# EAGLE design TSOC-ESP8266-EM-1-0 (EAGLE 6.6.0)
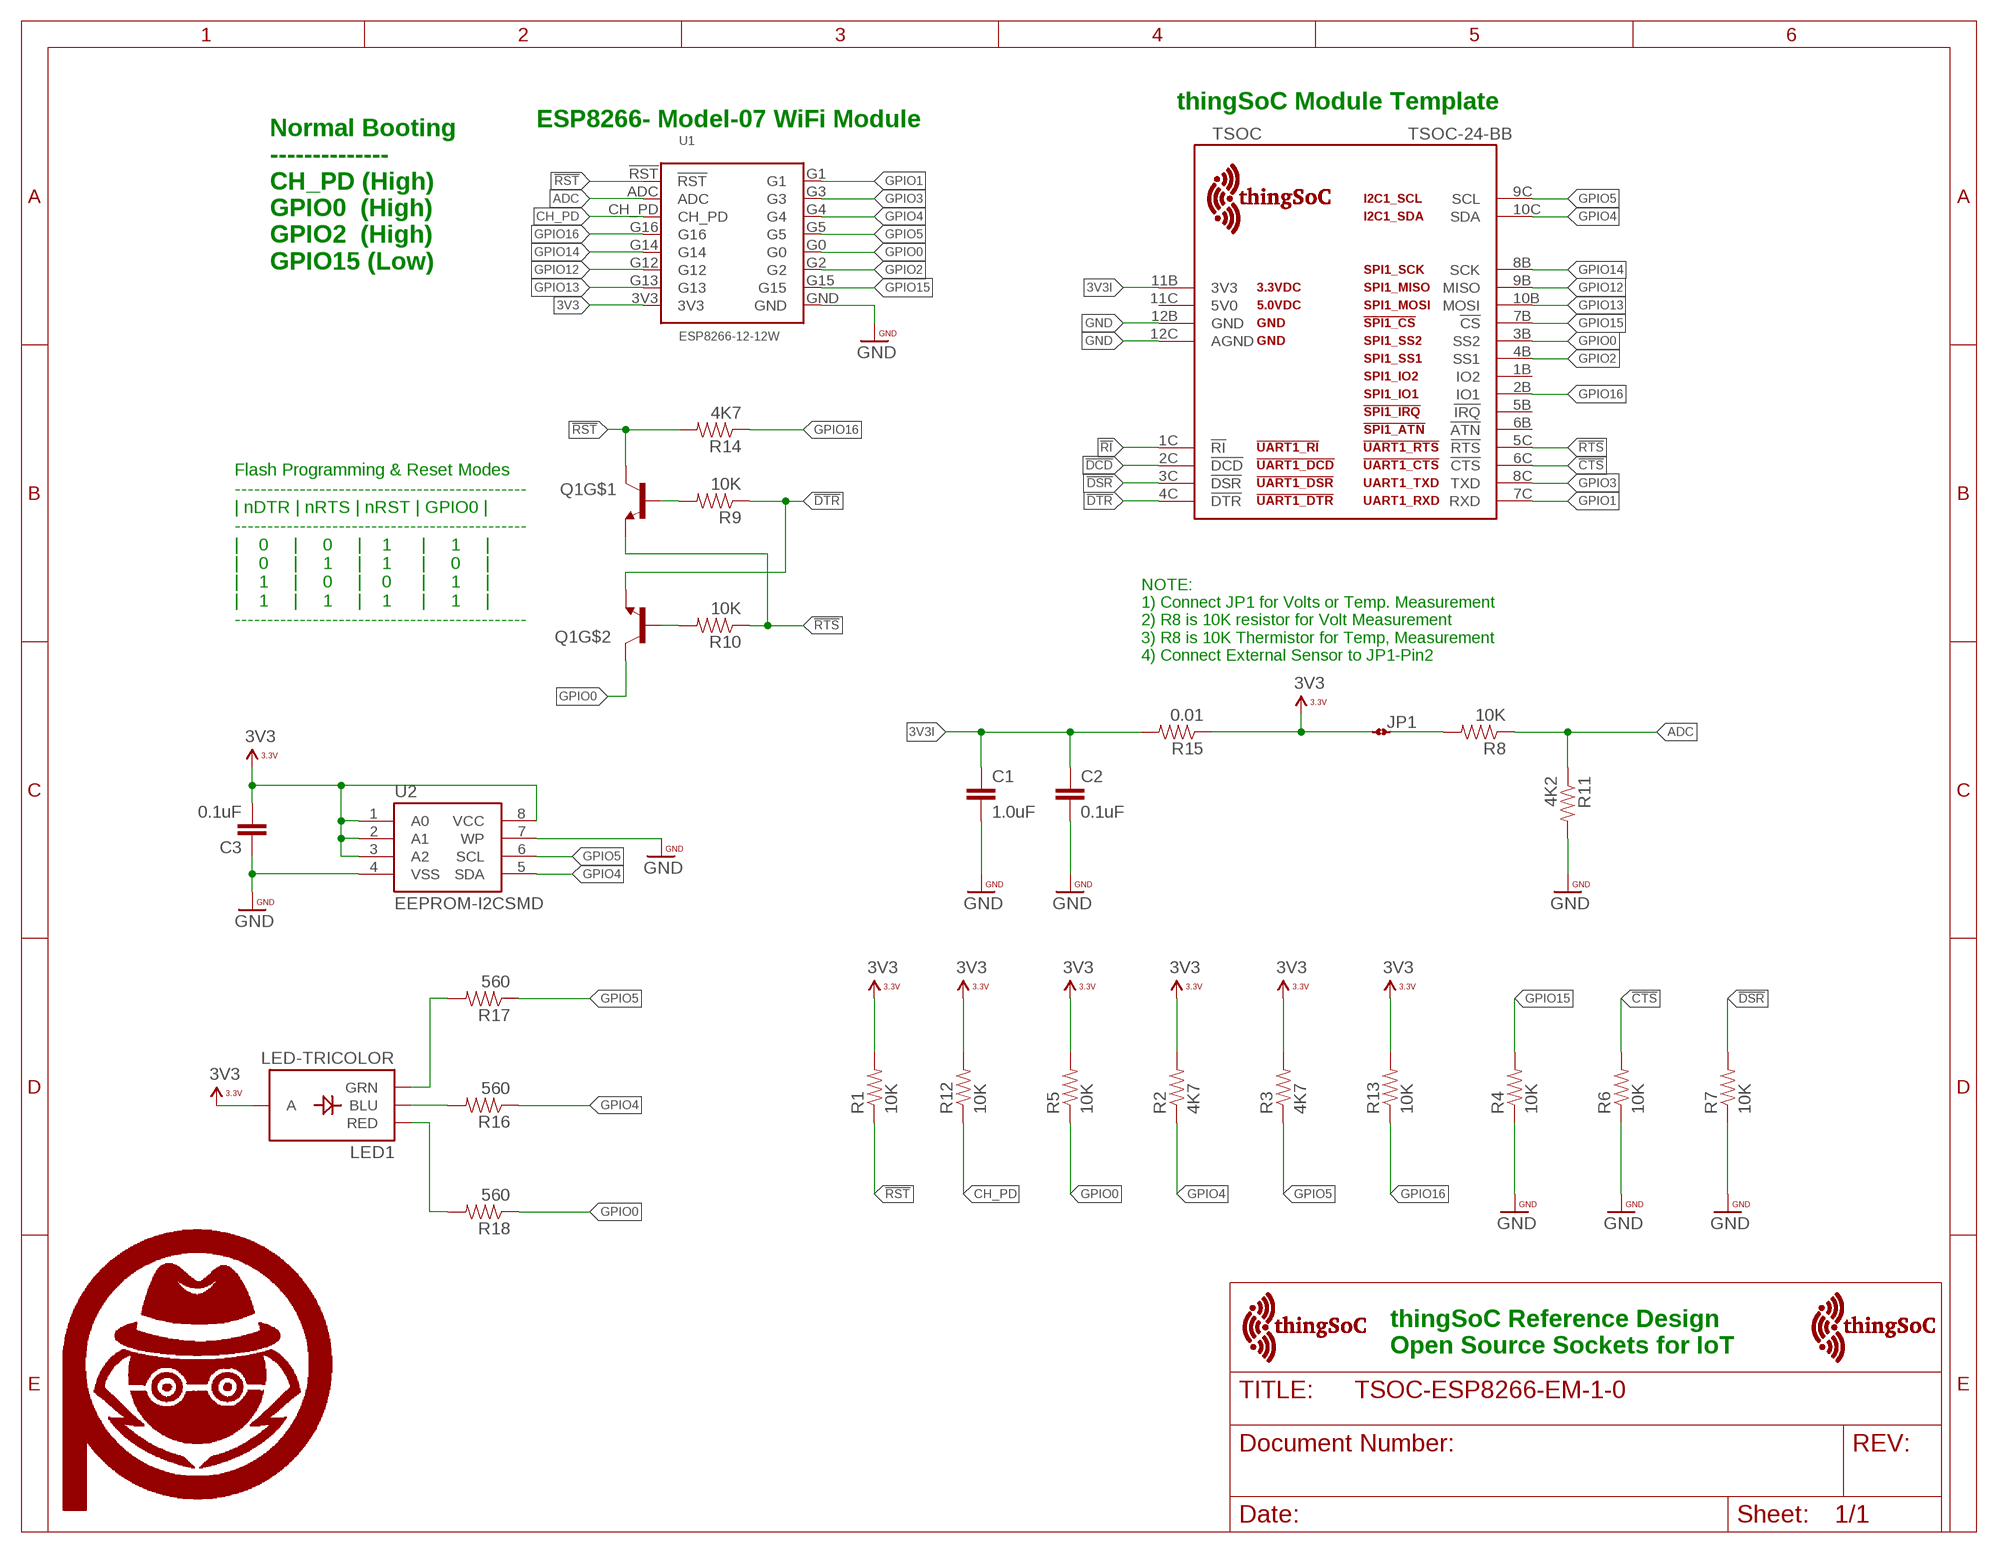
[diagram p0: schematic, sheet 1]

## Parts
C1  1.0uF  CAP0402-CAP  [0402-CAP]
C2  0.1uF  CAP0402-CAP  [0402-CAP]
C3  0.1uF  CAP0402-CAP  [0402-CAP]
JP1  JMP-2-NO-0402  [JMP-2-NO-0402]
LED1  LED-TRICOLOR  [LED-TRICOLOR-SMD]
Q1  MMBT2222A  MMDT3904  [SOT363]
R1  10K  RESISTOR0402  [0402-RES]
R2  4K7  RESISTOR0402  [0402-RES]
R3  4K7  RESISTOR0402  [0402-RES]
R4  10K  RESISTOR0402  [0402-RES]
R5  10K  RESISTOR0402  [0402-RES]
R6  10K  RESISTOR0402  [0402-RES]
R7  10K  RESISTOR0402  [0402-RES]
R8  10K  RESISTOR0402  [0402-RES]
R9  10K  RESISTOR0402  [0402-RES]
R10  10K  RESISTOR0402  [0402-RES]
R11  4K2  RESISTOR0402  [0402-RES]
R12  10K  RESISTOR0402  [0402-RES]
R13  10K  RESISTOR0402  [0402-RES]
R14  4K7  RESISTOR0402  [0402-RES]
R15  0.01  RESISTOR0402  [0402-RES]
R16  560  RESISTOR0402  [0402-RES]
R17  560  RESISTOR0402  [0402-RES]
R18  560  RESISTOR0402  [0402-RES]
TSOC  TSOC-24-BB  [TSOC-BB-S24]
U1  ESP8266-12-12W  [ESP8266-12W]
U2  EEPROM-I2CSMD  [SO08]
U$11  PA_LOGO_SYMMED  [PA_LOGO_AGENT_MED_SYM]
U$19  TSOC-LOGO-MED  [TSOC-LOGO-MED]
U$20  TSOC-LOGO-MED  [TSOC-LOGO-MED]

## Nets
3V3: C3.2 JP1.1 LED1.A R1.2 R2.2 R3.2 R5.2 R12.2 R13.2 R15.1 U1.3V3 U2.1(A0) U2.2(A1) U2.3(A2) U2.8(VCC)
3V3I: C1.1 C2.1 R15.2 TSOC.11B(3V3)
!CTS: R6.2 TSOC.6C(!CTS)
!DCD: TSOC.2C(!DCD)
!DSR: R7.2 TSOC.3C(!DSR)
!DTR: Q1.1(E) R9.1 TSOC.4C(!DTR)
!RI: TSOC.1C(!RI)
!RST: Q1.3(C) R1.1 R14.2 U1.!RST
!RTS: Q1.4(E) R10.1 TSOC.5C(!RTS)
ADC: R8.1 R11.1 U1.ADC
ADC_RAW: JP1.2 R8.2
BLU: LED1.B(BLU) R16.2
CH_PD: R12.1 U1.CH_PD
GND: C1.2 C2.2 C3.1 R4.1 R6.1 R7.1 R11.2 TSOC.12B(GND) TSOC.12C(AGND) U1.GND U2.4(VSS) U2.7(WP)
GPIO0: Q1.6(C) R5.1 R18.1 TSOC.3B(SS2) U1.G0
GPIO1: TSOC.7C(RXD) U1.G1
GPIO2: TSOC.4B(SS1) U1.G2
GPIO3: TSOC.8C(TXD) U1.G3
GPIO4: R2.1 R16.1 TSOC.10C(SDA) U1.G4 U2.5(SDA)
GPIO5: R3.1 R17.1 TSOC.9C(SCL) U1.G5 U2.6(SCL)
GPIO12: TSOC.9B(MISO) U1.G12
GPIO13: TSOC.10B(MOSI) U1.G13
GPIO14: TSOC.8B(SCK) U1.G14
GPIO15: R4.2 TSOC.7B(!CS) U1.G15
GPIO16: R13.1 R14.1 TSOC.2B(IO1) U1.G16
GRN: LED1.G(GRN) R17.2
N$6: Q1.5(B) R9.2
N$12: Q1.2(B) R10.2
RED: LED1.R(RED) R18.2
Unconnected: TSOC.1B(IO2) TSOC.5B(!IRQ) TSOC.6B(!ATN) TSOC.11C(5V0)

## Notes on the sheet
- thingSoC Module Template
- ESP8266- Model-07 WiFi Module
- Normal Booting
  --------------
  CH_PD (High)
  GPIO0  (High)
  GPIO2  (High) 
  GPIO15 (Low)
- Flash Programming & Reset Modes
  ---------------------------------------------
  | nDTR | nRTS | nRST | GPIO0 |
  ---------------------------------------------
  |    0     |     0     |    1      |     1     |
  |    0     |     1     |    1      |     0     |
  |    1     |     0     |    0      |     1     |
  |    1     |     1     |    1      |     1     |
  ---------------------------------------------
- NOTE:
  1) Connect JP1 for Volts or Temp. Measurement
  2) R8 is 10K resistor for Volt Measurement
  3) R8 is 10K Thermistor for Temp, Measurement
  4) Connect External Sensor to JP1-Pin2
- thingSoC Reference Design
  Open Source Sockets for IoT

## Library data of the parts
C1-C3 = PatternAgents-ProtoPads:CAP: Capacitor Standard 0603 ceramic capacitor, and 0.1" leaded capacitor.
JP1 = PatternAgents-ProtoPads:JMP-2-NO: Two Terminal Jumper - Normally Open Positions 1 and 2 are normally NOT connected. PatternAgents ProtoPads Library Schematic and PCB layout libraries for design patterns by PatternAgents. For the CADSoft Eagle CAD program : http://www.cadsoftusa.com/download-eagle/ Source LBR : http://www.patternagents.com Github : https://github.com/PatternAgents License : http://creativecommons.org/licenses/by-sa/4.0/ (Creative Commons 4.0) THIS SOFTWARE IS PROVIDED BY THE CONTRIBUTORS "AS IS" AND WITHOUT ANY EXPRESS OR IMPLIED WARRANTIES, INCLUDING, BUT NOT LIMITED TO, THE IMPLIED WARRANTIES OF MERCHANTABILITY AND FITNESS FOR A PARTICULAR PURPOSE ARE DISCLAIMED. IN NO EVENT SHALL THE COPYRIGHT OWNER OR CONTRIBUTORS BE LIABLE FOR ANY DIRECT, INDIRECT, INCIDENTAL, SPECIAL, EXEMPLARY, OR CONSEQUENTIAL DAMAGES (INCLUDING, BUT NOT LIMITED TO, PROCUREMENT OF SUBSTITUTE GOODS OR SERVICES; LOSS OF USE, DATA, OR PROFITS; OR BUSINESS INTERRUPTION) HOWEVER CAUSED AND ON ANY THEORY OF LIABILITY, WHETHER IN CONTRACT, STRICT LIABILITY, OR TORT (INCLUDING NEGLIGENCE OR OTHERWISE) ARISING IN ANY WAY OUT OF THE USE OF THIS SOFTWARE, EVEN IF ADVISED OF THE POSSIBILITY OF SUCH DAMAGE.; BOM: EXCLUDE
LED1 = SparkFun-LED:LED-TRICOLOR: Tri-Color LED SMD Proven layout and schematic for triple color LED in SMD package - common anode. Spark Fun Electronics SKU : COM-07844
Q1 = SparkFun-DiscreteSemi:MMDT3904: Dual NPN transistor
R1-R18 = PatternAgents-ProtoPads:RESISTOR: Resistor Basic schematic elements and footprints for 0603, 1206, and PTH resistors.
TSOC = thingSoC:TSOC-24: thingSoC Twenty-Four(24) Pin Socket Source LBR : http://www.thingsoc.com Github : https://github.com/thingsoc License : http://creativecommons.org/licenses/by-sa/4.0/ (Creative Commons 4.0) THIS SOFTWARE IS PROVIDED BY THE CONTRIBUTORS "AS IS" AND WITHOUT ANY EXPRESS OR IMPLIED WARRANTIES, INCLUDING, BUT NOT LIMITED TO, THE IMPLIED WARRANTIES OF MERCHANTABILITY AND FITNESS FOR A PARTICULAR PURPOSE ARE DISCLAIMED. IN NO EVENT SHALL THE COPYRIGHT OWNER OR CONTRIBUTORS BE LIABLE FOR ANY DIRECT, INDIRECT, INCIDENTAL, SPECIAL, EXEMPLARY, OR CONSEQUENTIAL DAMAGES (INCLUDING, BUT NOT LIMITED TO, PROCUREMENT OF SUBSTITUTE GOODS OR SERVICES; LOSS OF USE, DATA, OR PROFITS; OR BUSINESS INTERRUPTION) HOWEVER CAUSED AND ON ANY THEORY OF LIABILITY, WHETHER IN CONTRACT, STRICT LIABILITY, OR TORT (INCLUDING NEGLIGENCE OR OTHERWISE) ARISING IN ANY WAY OUT OF THE USE OF THIS SOFTWARE, EVEN IF ADVISED OF THE POSSIBILITY OF SUCH DAMAGE.
U1 = PatternAgents_RFmodules:ESP8266-12: Pattern Agents ESP8266 (Type12 : 16 Pins) PatternAgents Prototyping/Pads Library Schematic & PCB Layout Symbols for Prototyping Boards. Pads in this library have been lengthened for hand soldering & prototyping. Schematic and PCB layout libraries for design patterns by PatternAgents. For the CADSoft Eagle CAD program : http://www.cadsoftusa.com/download-eagle/ Github : https://github.com/PatternAgents License : http://creativecommons.org/licenses/by-sa/4.0/ (Creative Commons 4.0) THIS SOFTWARE IS PROVIDED BY THE CONTRIBUTORS "AS IS" AND WITHOUT ANY EXPRESS OR IMPLIED WARRANTIES, INCLUDING, BUT NOT LIMITED TO, THE IMPLIED WARRANTIES OF MERCHANTABILITY AND FITNESS FOR A PARTICULAR PURPOSE ARE DISCLAIMED. IN NO EVENT SHALL THE COPYRIGHT OWNER OR CONTRIBUTORS BE LIABLE FOR ANY DIRECT, INDIRECT, INCIDENTAL, SPECIAL, EXEMPLARY, OR CONSEQUENTIAL DAMAGES (INCLUDING, BUT NOT LIMITED TO, PROCUREMENT OF SUBSTITUTE GOODS OR SERVICES; LOSS OF USE, DATA, OR PROFITS; OR BUSINESS INTERRUPTION) HOWEVER CAUSED AND ON ANY THEORY OF LIABILITY, WHETHER IN CONTRACT, STRICT LIABILITY, OR TORT (INCLUDING NEGLIGENCE OR OTHERWISE) ARISING IN ANY WAY OUT OF THE USE OF THIS SOFTWARE, EVEN IF ADVISED OF THE POSSIBILITY OF SUCH DAMAGE.
U2 = SparkFun-DigitalIC:EEPROM-I2C: I2C EEPROM chips, 24LC256 (and others)
U$11 = PatternAgents-Logos:PA_LOGO_SYM: PatternAgents Logo Symbol Trademark : PatternAgents, LLC Github : https://github.com/PatternAgents/PCB_Libraries License : http://creativecommons.org/licenses/by-sa/3.0/ (Creative Commons 3.0) THIS SOFTWARE IS PROVIDED BY THE CONTRIBUTORS "AS IS" AND WITHOUT ANY EXPRESS OR IMPLIED WARRANTIES, INCLUDING, BUT NOT LIMITED TO, THE IMPLIED WARRANTIES OF MERCHANTABILITY AND FITNESS FOR A PARTICULAR PURPOSE ARE DISCLAIMED. IN NO EVENT SHALL THE COPYRIGHT OWNER OR CONTRIBUTORS BE LIABLE FOR ANY DIRECT, INDIRECT, INCIDENTAL, SPECIAL, EXEMPLARY, OR CONSEQUENTIAL DAMAGES (INCLUDING, BUT NOT LIMITED TO, PROCUREMENT OF SUBSTITUTE GOODS OR SERVICES; LOSS OF USE, DATA, OR PROFITS; OR BUSINESS INTERRUPTION) HOWEVER CAUSED AND ON ANY THEORY OF LIABILITY, WHETHER IN CONTRACT, STRICT LIABILITY, OR TORT (INCLUDING NEGLIGENCE OR OTHERWISE) ARISING IN ANY WAY OUT OF THE USE OF THIS SOFTWARE, EVEN IF ADVISED OF THE POSSIBILITY OF SUCH DAMAGE.
U$19 U$20 = thingSoC:TSOC-LOGO: thingSoC Logo Source LBR : http://www.thingsoc.com Github : https://github.com/thingsoc License : http://creativecommons.org/licenses/by-sa/4.0/ (Creative Commons 4.0) THIS SOFTWARE IS PROVIDED BY THE CONTRIBUTORS "AS IS" AND WITHOUT ANY EXPRESS OR IMPLIED WARRANTIES, INCLUDING, BUT NOT LIMITED TO, THE IMPLIED WARRANTIES OF MERCHANTABILITY AND FITNESS FOR A PARTICULAR PURPOSE ARE DISCLAIMED. IN NO EVENT SHALL THE COPYRIGHT OWNER OR CONTRIBUTORS BE LIABLE FOR ANY DIRECT, INDIRECT, INCIDENTAL, SPECIAL, EXEMPLARY, OR CONSEQUENTIAL DAMAGES (INCLUDING, BUT NOT LIMITED TO, PROCUREMENT OF SUBSTITUTE GOODS OR SERVICES; LOSS OF USE, DATA, OR PROFITS; OR BUSINESS INTERRUPTION) HOWEVER CAUSED AND ON ANY THEORY OF LIABILITY, WHETHER IN CONTRACT, STRICT LIABILITY, OR TORT (INCLUDING NEGLIGENCE OR OTHERWISE) ARISING IN ANY WAY OUT OF THE USE OF THIS SOFTWARE, EVEN IF ADVISED OF THE POSSIBILITY OF SUCH DAMAGE.

## Board
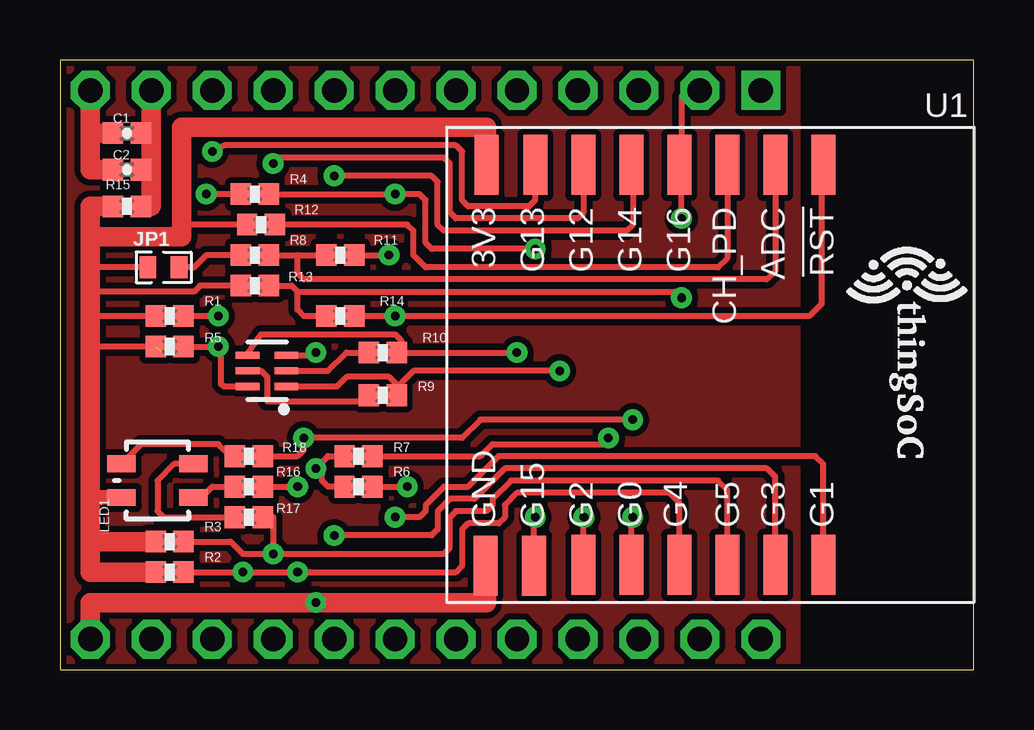
[diagram p1: board, top side]
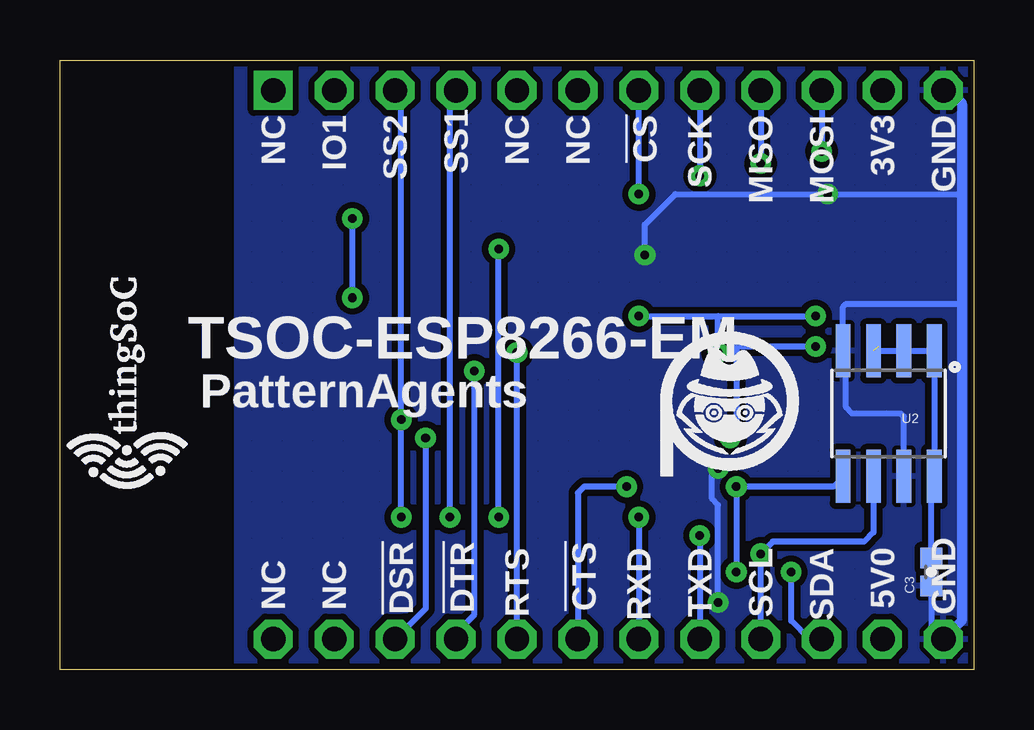
[diagram p2: board, bottom side, seen from below]

Size 38.1 x 25.4 mm. Coordinates in mm from the lower left corner, seen from the top.
Outline: 0,0 38.1,0 38.1,25.4 0,25.4 0,0
Copper layers (1*16): Top 0.035mm / dielectric 1.5mm / Bottom 0.035mm
Design rules "PatternAgents_7mil": minimum track width 7mil, minimum drill 14mil, track to track 7mil, track to pad 7mil, pad to pad 7mil, via to via 7mil, smd to smd 7mil, copper to edge 7mil, drill to drill 7mil, minimum pad ring 12mil, minimum via ring 10mil, stop-mask expansion 4mil, vias tented up to drill 25mil, thermal gap 7mil

### Footprints (pad centres in the part's own frame; a part is rotated, then mirrored left to right if it is on the bottom)
0402-CAP = smd 0.85 x 0.9: 1 -0.58,0; 2 0.58,0
JMP-2-NO-0402 = smd 0.7 x 0.9: 1 -0.65,0; 2 0.65,0
LED-TRICOLOR-SMD = smd 0.7 x 1.2: A 0.7,-1.5; B 0.7,1.5; G -0.7,1.5; R -0.7,-1.5
SOT363 = smd 0.3 x 0.99: 1 -0.65,-0.8; 2 0,-0.8; 3 0.65,-0.8; 4 0.65,0.81; 5 0,0.81; 6 -0.65,0.81
0402-RES = smd 0.85 x 0.9: 1 -0.58,0; 2 0.58,0
TSOC-BB-S24 = drill 1.016 square: 1B -11.43,-11.43 | drill 1.016 octagon: 1C -11.43,11.43; 2B -8.89,-11.43; 2C -8.89,11.43; 3B -6.35,-11.43; 3C -6.35,11.43; 4B -3.81,-11.43; 4C -3.81,11.43; 5B -1.27,-11.43; 5C -1.27,11.43; 6B 1.27,-11.43; 6C 1.27,11.43; 7B 3.81,-11.43; 7C 3.81,11.43; 8B 6.35,-11.43; 8C 6.35,11.43; 9B 8.89,-11.43; 9C 8.89,11.43; 10B 11.43,-11.43; 10C 11.43,11.43; 11B 13.97,-11.43; 11C 13.97,11.43; 12B 16.51,-11.43; 12C 16.51,11.43
ESP8266-12W = smd 1 x 2.5: 3V3 8.888,-8.582; !RST -5.144,-8.582; ADC -3.144,-8.582; CH_PD -1.144,-8.582; G0 2.856,8.082; G1 -5.144,8.082; G2 4.856,8.082; G3 -3.144,8.082; G4 0.856,8.082; G5 -1.144,8.082; G12 4.856,-8.582; G13 6.856,-8.582; G14 2.856,-8.582; G15 6.904,8.126; G16 0.856,-8.582; GND 8.936,8.126
SO08 = smd 0.61 x 2.21: 1 -1.905,-2.616; 2 -0.635,-2.616; 3 0.635,-2.616; 4 1.905,-2.616; 5 1.905,2.616; 6 0.635,2.616; 7 -0.635,2.616; 8 -1.905,2.616

### Placement (x,y rotation side)
C1  2.79,22.35 180 top
C2  2.79,20.83 180 top
C3  1.78,4.06 90 bottom
JP1  4.32,16.76 0 top
LED1  4.06,7.87 270 top
Q1  8.64,12.45 90 top
R1  4.57,14.73 180 top
R2  4.57,4.06 180 top
R3  4.57,5.33 180 top
R4  8.13,19.81 0 top
R5  4.57,13.46 180 top
R6  12.45,7.62 0 top
R7  12.45,8.89 0 top
R8  8.13,17.27 180 top
R9  13.46,11.43 180 top
R10  13.46,13.21 180 top
R11  11.68,17.27 0 top
R12  8.38,18.54 180 top
R13  8.13,16 180 top
R14  11.68,14.73 0 top
R15  2.79,19.3 0 top
R16  7.87,7.62 180 top
R17  7.87,6.35 180 top
R18  7.87,8.89 180 top
TSOC  17.78,12.7 180 top
U1  26.67,12.45 180 top
U2  3.56,10.67 180 bottom
U$11  10.16,10.67 0 bottom
U$19  35.31,9.14 90 bottom
U$20  35.31,16 270 top

### Tracks (layer width: path | path; a pad name or v marks a point on that pad's centre or on a via)
3V3  (1 unrouted)
  Top 0.254: R12.2 5.08,18.54 | R1.2 1.27,14.73 | JP1.1 1.27,16.76 | R13.2 5.84,16 5.59,15.75 1.52,15.75 1.27,16 | R5.2 1.27,13.46
  Top 0.61: 1.25,9.88 1.27,10.16 | LED1.A 1.46,7.17 1.27,7.37
  Top 0.813: 1.27,18.03 1.27,19.3 R15.1 | 1.27,18.03 1.27,16.76 1.27,16 1.27,14.73 1.27,13.46 1.27,10.16 1.27,7.37 1.27,5.33 | 1.27,5.33 1.27,4.06 R2.2 | R3.2 1.27,5.33 | U1.3V3 17.78,22.61 5.08,22.61 5.08,18.54 5.08,18.03 1.27,18.03
  Bottom 0.254: U2.3 U2.2 U2.1 U2.8 1.78,7.92 C3.2
3V3I
  Top 0.813: TSOC.11B 3.81,22.35 | 3.81,22.35 3.81,20.83 | 3.81,20.83 3.81,19.3 R15.2 | C1.1 3.81,22.35 | C2.1 3.81,20.83
!CTS  (via drill 0.36)
  Top 0.254: R6.2 v14.48,7.62
  Bottom 0.254: v14.48,7.62 16.26,7.62 16.51,7.37 TSOC.6C
!DSR  (via drill 0.36)
  Top 0.254: R7.2 17.53,8.89 18.03,9.4 22.61,9.4 v22.86,9.65
  Bottom 0.254: v22.86,9.65 22.86,2.54 TSOC.3C
!DTR  (via drill 0.36)
  Top 0.254: 14.3,11.68 R9.1 | R9.1 14.04,11.87 13.72,12.19 11.94,12.19 11.54,11.8 Q1.1 | v20.83,12.45 14.73,12.45 14.22,11.94 14.22,11.61 R9.1
  Bottom 0.254: TSOC.4C 21.59,1.52 20.83,2.29 v20.83,12.45
!RST  (via drill 0.36)
  Top 0.178: U1.!RST 31.75,21.08 31.75,20.96
  Top 0.254: 31.75,20.96 31.75,15.24 31.24,14.73 v13.97,14.73 R14.2 12.19,14.66 | Q1.3 10.56,13.1 v10.67,13.21 | v6.6,14.73 R1.1
  Bottom 0.254: v13.97,14.73 10.67,14.73 | 10.67,14.73 v6.6,14.73 | v10.67,13.21 10.67,14.73
!RTS  (via drill 0.36)
  Top 0.254: v19.05,13.21 R10.1 14.22,13.39 14.22,13.72 13.97,13.97 8.38,13.97 7.83,13.16 Q1.4
  Bottom 0.254: TSOC.5C v19.05,13.21
ADC
  Top 0.254: R8.1 9.91,17.27 | 9.91,17.27 R11.1 | U1.ADC 29.81,16.61 29.46,16.26 10.16,16.26 9.91,16.51 9.91,17.27
ADC_RAW
  Top 0.254: R8.2 6.1,17.27 5.59,16.76 JP1.2
BLU
  Top 0.254: 7.04,7.87 R16.2 6.35,7.62 5.9,7.17 LED1.B
CH_PD
  Top 0.254: U1.CH_PD 27.81,17.15 27.43,16.76 15.24,16.76 14.73,17.27 14.73,18.29 14.48,18.54 R12.1
GND  (via drill 0.36)
  Top 0.254: R4.1 v6.1,19.81 | R11.2 v13.72,17.27 | R7.1 11.18,8.89 v10.67,8.38 10.92,8.13 10.92,7.87 11.18,7.62 R6.1
  Top 0.61: U1.GND 17.78,4.32 17.78,3.56
  Top 0.813: 17.78,3.56 17.78,2.79 v10.67,2.79 1.27,2.79 TSOC.12C | TSOC.12B 1.27,22.35 | 1.27,22.35 C1.2 | C2.2 1.27,20.83 1.27,22.35
  Bottom 0.254: 0.51,19.81 v6.1,19.81 12.45,19.81 13.72,18.54 v13.72,17.27 | v10.67,2.79 10.67,6.86 10.92,7.11 10.92,8.13 v10.67,8.38 | U2.7 2.92,10.54 3.05,10.67 5.08,10.67 5.33,10.92 5.33,13.16 U2.4 5.46,15.11 5.33,15.24 0.51,15.24 | C3.1 1.78,1.78 TSOC.12C
  Bottom 0.406: TSOC.12B 1.02,24.13 0.51,23.62 0.51,19.81 0.51,15.24 0.51,2.03 TSOC.12C
  pour Bottom (isolate 0.254, hatched): 0,0 0,25.4 30.73,25.4 30.73,0
GPIO0  (via drill 0.36)
  Top 0.254: U1.G0 23.81,6.29 v23.88,6.35 | R5.1 v6.6,13.46 6.71,13.35 6.71,11.91 6.83,11.8 Q1.6 7.87,11.75 | v23.88,10.41 17.53,10.41 16.76,9.65 v10.16,9.65 10.16,9.14 9.91,8.89 R18.1
  Bottom 0.254: v23.88,6.35 v23.88,10.41 23.88,23.88 TSOC.3B | v6.6,13.46 9.91,13.46 9.91,9.91 v10.16,9.65
GPIO1  (via drill 0.36)
  Top 0.254: U1.G1 31.81,8.57 31.5,8.89 18.29,8.89 17.02,7.62 16,7.62 15.24,6.86 15.24,6.6 14.99,6.35 v13.97,6.35
  Bottom 0.254: v13.97,6.35 TSOC.7C
GPIO2  (via drill 0.36)
  Top 0.254: U1.G2 21.81,6.32 v21.84,6.35
  Bottom 0.254: v21.84,6.35 21.84,23.88 TSOC.4B
GPIO3  (via drill 0.36)
  Top 0.254: U1.G3 29.81,8.03 29.46,8.38 18.54,8.38 17.27,7.11 16.26,7.11 15.75,6.6 15.75,5.84 15.49,5.59 v11.43,5.59
  Bottom 0.254: v11.43,5.59 TSOC.8C
GPIO4  (via drill 0.36)
  Top 0.254: U1.G4 25.81,6.95 25.4,7.37 19.05,7.37 18.54,6.86 18.54,6.35 18.29,6.1 17.02,6.1 16.76,5.84 16.76,4.32 16.51,4.06 10.41,4.06 v9.91,4.06 v7.62,4.06 R2.1 | R16.1 v9.91,7.62
  Bottom 0.254: TSOC.10C 6.86,1.27 7.62,2.03 v7.62,4.06 | U2.5 5.46,8 5.84,7.62 v9.91,7.62 v9.91,4.06
GPIO5  (via drill 0.36)
  Top 0.254: U1.G5 27.81,7.49 27.43,7.87 18.8,7.87 18.03,7.11 18.03,6.86 17.78,6.6 16.51,6.6 16.26,6.35 16.26,5.08 16,4.83 v8.89,4.83 | R3.1 7.11,5.33 7.62,4.83 v8.89,4.83 | R17.1 8.89,6.35 v8.89,4.83
  Bottom 0.254: TSOC.9C v8.89,4.83 8.38,5.33 4.57,5.33 4.19,5.71 U2.6
GPIO12  (via drill 0.36)
  Top 0.254: U1.G12 21.81,19.02 21.59,18.8 16.51,18.8 16.26,19.05 16.26,21.08 16,21.34 9.14,21.34 v8.89,21.08
  Bottom 0.254: TSOC.9B v8.89,21.08
GPIO13  (via drill 0.36)
  Top 0.254: U1.G13 19.81,19.56 19.56,19.3 17.02,19.3 16.76,19.56 16.76,21.59 16.51,21.84 6.86,21.84 v6.35,21.59
  Bottom 0.254: TSOC.10B v6.35,21.59
GPIO14  (via drill 0.36)
  Top 0.254: U1.G14 23.88,20.97 23.88,18.54 23.62,18.29 16,18.29 15.75,18.54 15.75,20.32 15.49,20.57 v11.43,20.57
  Bottom 0.254: TSOC.8B v11.43,20.57
GPIO15  (via drill 0.36)
  Top 0.254: U1.G15 19.77,6.05 v19.81,6.35 | v19.81,17.53 15.49,17.53 15.24,17.78 15.24,19.56 14.99,19.81 v13.97,19.81 R4.2
  Bottom 0.254: v19.81,6.35 v19.81,17.53 | v13.97,19.81 TSOC.7B
GPIO16  (via drill 0.36)
  Top 0.254: TSOC.2B 26.16,24.13 25.91,23.88 25.91,21.12 U1.G16 25.91,20.93 v25.91,18.8 | R13.1 9.65,16 9.91,15.75 | 9.91,15.75 25.65,15.75 v25.91,15.49 | R14.1 10.16,14.73 9.91,14.99 9.91,15.75
  Bottom 0.254: v25.91,15.49 v25.91,18.8
GRN
  Top 0.254: LED1.G 4.76,8.57 4.06,7.87 4.06,6.6 4.32,6.35 R17.2
N$1
  pour Top (isolate 0.254, hatched): 0,0 0,25.4 30.73,25.4 30.73,0
N$6
  Top 0.254: Q1.5 8.38,12.45 8.64,12.19 8.64,11.18 12.63,11.18 R9.2
N$12
  Top 0.254: Q1.2 11.18,12.45 11.94,13.21 R10.2
RED
  Top 0.254: R18.2 7.11,8.89 6.6,9.4 3.39,9.4 LED1.R

### Text on the board
bPlace: SS1 | GND | 3V3 | MOSI | MISO | SCK | !CS | NC | NC | SS2 | IO1 | NC | TSOC-ESP8266-EM | PatternAgents | !CTS | !DTR | !DSR | 5V0 | SDA | SCL | TXD | RXD | RTS | NC | NC | GND